# Altium schematic sheet Voltage Regulators.SchDoc: Voltage Regulation
size A4; Author: Khoi Ly; DrawnBy: Khoi Ly; Organization: University of Colorado; Address1: 1111 Engineering Drive; Address2: Boulder; Address3: CO, 870309; Address4: USA; DocumentNumber: 1; Revision: 1; SheetNumber: 3; SheetTotal: 4; DocumentName: Voltage Regulators.SchDoc
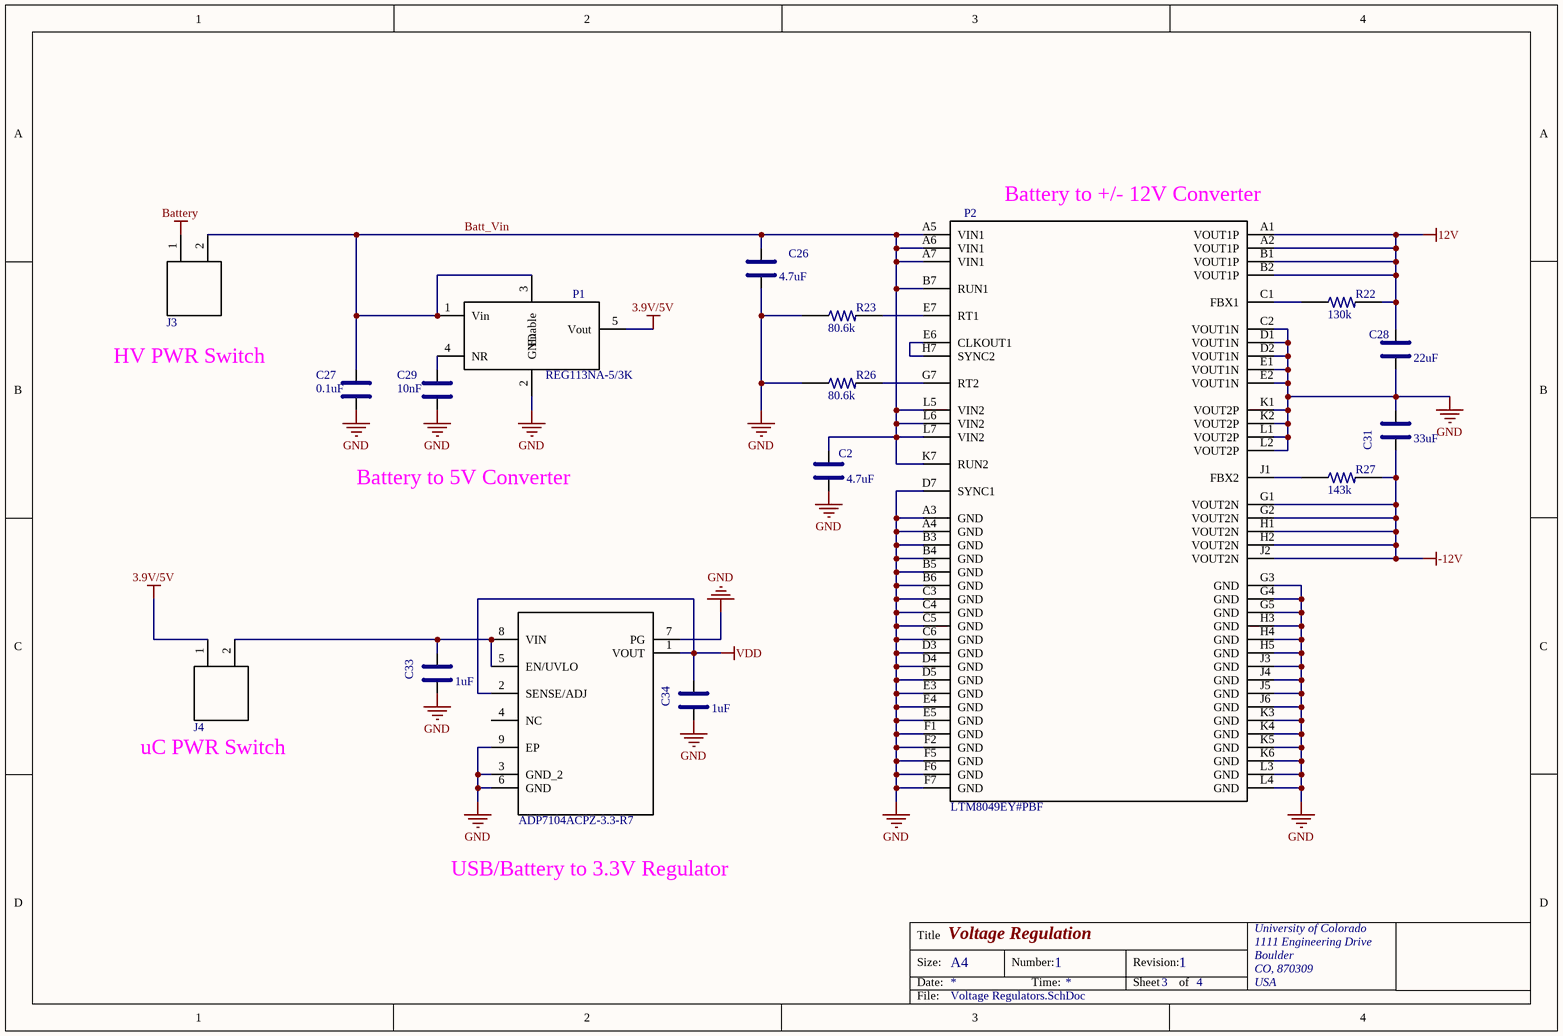
[diagram p0: Voltage Regulators.SchDoc]

## Parts
C2  value 4.7uF  [C0402C102K9RACTU]  (hidden comment: GRM155R60J475)
C26  value 4.7uF  [C0402C102K9RACTU]  (hidden comment: GRM155R60J475)
C27  value 0.1uF  [CL03A104KA3NNNC]  (hidden comment: CL03A104KA3NNNC)
C28  value 22uF  [CL21A226MAQNNNE]  (hidden comment: CL21A226MAQNNNE)
C29  value 10nF  [CL03A104KA3NNNC]  (hidden comment: CL03A104KA3NNNC)
C31  value 33uF  [GRM31CR61E476ME44L]  (hidden comment: GRM31CR61E476ME44L)
C33  value 1uF  [GRM033R60J105MEA2D]  (hidden comment: GRM033R60J105MEA2D)
C34  value 1uF  [GRM033R60J105MEA2D]  (hidden comment: GRM033R60J105MEA2D)
J3  BM02B-SRSS-TBT  [BM02B-SRSS-TBT]  (value not drawn)
J4  BM02B-SRSS-TBT  [BM02B-SRSS-TBT]  (value not drawn)
P1  REG113NA-5/3K  [REG113NA-5/3K]
P2  LTM8049EY#PBF  [LTM8049EY#PBF]
P3  ADP7104ACPZ-3.3-R7  [ADP7104ARDZ-3.3]
R22  value 130k  [RC0201FR-07130KL]  (hidden comment: RC0201FR-07130KL)
R23  value 80.6k  [RC0201FR-0780K6L]  (hidden comment: RC0201FR-0780K6L)
R26  value 80.6k  [RC0201FR-0780K6L]  (hidden comment: RC0201FR-0780K6L)
R27  value 143k  [RC0201FR-07143KL]  (hidden comment: RC0201FR-07143KL)

## Nets
3.9V/5V: J4.1 P1.5(Vout)
12V: C28.1 P2.A1(VOUT1P) P2.A2(VOUT1P) P2.B1(VOUT1P) P2.B2(VOUT1P) R22.1
-12V: C31.2 P2.G1(VOUT2N) P2.G2(VOUT2N) P2.H1(VOUT2N) P2.H2(VOUT2N) P2.J2(VOUT2N) R27.1
Battery: J3.1
GND: C2.2 C26.2 C27.1 C28.2 C29.2 C31.1 C33.2 C34.2 P1.2(GND) P2.A3(GND) P2.A4(GND) P2.B3(GND) P2.B4(GND) P2.B5(GND) P2.B6(GND) P2.C2(VOUT1N) P2.C3(GND) P2.C4(GND) P2.C5(GND) P2.C6(GND) P2.D1(VOUT1N) P2.D2(VOUT1N) P2.D3(GND) P2.D4(GND) P2.D5(GND) P2.D7(SYNC1) P2.E1(VOUT1N) P2.E2(VOUT1N) P2.E3(GND) P2.E4(GND) P2.E5(GND) P2.F1(GND) P2.F2(GND) P2.F5(GND) P2.F6(GND) P2.F7(GND) P2.G3(GND) P2.G4(GND) P2.G5(GND) P2.H3(GND) P2.H4(GND) P2.H5(GND) P2.J3(GND) P2.J4(GND) P2.J5(GND) P2.J6(GND) P2.K1(VOUT2P) P2.K2(VOUT2P) P2.K3(GND) P2.K4(GND) P2.K5(GND) P2.K6(GND) P2.L1(VOUT2P) P2.L2(VOUT2P) P2.L3(GND) P2.L4(GND) P3.3(GND_2) P3.6(GND) P3.7(PG) P3.9(EP) R23.2 R26.2
VDD: C34.1 P3.1(VOUT) P3.2(SENSE/ADJ)
Batt_Vin: C2.1 C26.1 C27.2 J3.2 P1.1(Vin) P1.3(Enable) P2.A5(VIN1) P2.A6(VIN1) P2.A7(VIN1) P2.B7(RUN1) P2.K7(RUN2) P2.L5(VIN2) P2.L6(VIN2) P2.L7(VIN2)
NetC29_1: C29.1 P1.4(NR)
NetC33_1: C33.1 J4.2 P3.5(EN/UVLO) P3.8(VIN)
NetP2_C1: P2.C1(FBX1) R22.2
NetP2_E6: P2.E6(CLKOUT1) P2.H7(SYNC2)
NetP2_E7: P2.E7(RT1) R23.1
NetP2_G7: P2.G7(RT2) R26.1
NetP2_J1: P2.J1(FBX2) R27.2

Not connected (* = marked no-connect by the designer): P3 4(NC)

## Notes on the sheet
- (near P2) Battery to +/- 12V Converter
- HV PWR Switch
- Battery to 5V Converter
- uC PWR Switch
- USB/Battery to 3.3V Regulator
- Title
- Size:
- Date:
- A4
- Number:
- Time:
- Revision:
- Sheet
- of
- File:

## Library data of the parts
C2 C26 = GRM155R60J475: CAP CER 4.7UF 6.3V X5R 0402; Manufacturer: Murata; Manufacturer Part Number: GRM155R60J475ME47D‎; Package: 0402; Digikey Part Number: ‎490-5915-1-ND‎; Voltage Rated: 6.3V; Temperature Coefficient: X5R; Unit Price: $0.55; Supplier: Digikey
C27 C29 = CL03A104KA3NNNC: CAP CER 0.1UF 25V X5R 0201; Manufacturer: Samsung; Package: 0201 (0603 Metric); Manufacturer Part Number: CL03A104KA3NNNC; Digikey Part Number: 1276-1318-6-ND; Voltage Rated: 25V; Temperature Coefficient: X5R; Unit Price: $0.75; Supplier: Digikey
C28 = CL21A226MAQNNNE: CAP CER 22UF 25V X5R 0805; Manufacturer: Samsung; Package: 0603 (1608 Metric); Manufacturer Part Number: CL21A226MAQNNNE; Digikey Part Number: 1276-2908-1-ND; Voltage Rated: 25V; Temperature Coefficient: X5R; Unit Price: $0.75; Supplier: Digikey
C31 = C3216JB1E336M160AC: CAP CER 33UF 25V JB 1206; Manufacturer: TDK Corporation; Temperature Coefficient: X5R; Package: 1206 (3216 Metric); Manufacturer Part Number: C3216JB1E336M160AC; Digikey Part Number: 445-11710-1-ND; Voltage Rated: 25V; Unit Price: $0.75; Supplier: Digikey
C33 C34 = GRM033R60J105MEA2D: CAP CER 1UF 6.3V X5R 0201; Manufacturer: Murata; Package: 0201 (0603 Metric); Manufacturer Part Number: GRM033R60J105MEA2D; Digikey Part Number: 490-7229-1-ND; Voltage Rated: 6.3V; Temperature Coefficient: X5R; Unit Price: $0.15; Supplier: Digikey
J3 J4 = BM02B-SRSS-TBT: CONN WIRE HDR 2POS 1MM STSMD; Manufacturer: JST; Digikey Part Number: 455-2955-1-ND; Unit Price: $7.85; Manufacturer Part Number: BM02B-SRSS-TBT
P1 = REG113NA-5/3K: LDO Voltage Regulators DMOS 400mA Regulator Low-Dropout; Manufacturer: LT; Package: SOT-23-5; Manufacturer Part Number: REG113NA-5/3K; Digikey: REG113NA-5/3KCT-ND; Unit Price: $2.76; Supplier: Digikey
P2 = LTM8049EY#PBF: DC DC CONVERTER +/-2.5 TO +/-24V; Manufacturer: Linear Technology; Digikey Part Number: LTM8049EY#PBF-ND; Manufacturer Part Number: LTM8049EY#PBF; Unit Price: $24.75; Package / Case: 77-BBGA
P3 = ADP7104ACPZ-3.3-R7: IC REG LINEAR 3.3V 500MA 8LFCSP; Manufacturer: Analog Devices; Voltage Output: 3.3V (fixed); Voltage Input: 20V (max); Manufacturer Part Number: ADP7104ACPZ-3.3-R7; Digikey Part Number: ADP7104ACPZ-3.3-R7DKR-ND; Current Output: 500mA; Package: 8-LFCSP_WD; Unit Price: $4.5
R22 = RC0201FR-07130KL: RES SMD 130K OHM 1% 1/20W 0201; Manufacturer: Yageo; Power (Watts): 0.05W; Package: 0201 (0603 Metric); Manufacturer Part Number: RC0201FR-07130KL; Digikey Part Number: YAG2393DKR-ND; Unit Price: 0.1; Supplier: Digikey
R23 R26 = RC0201FR-0780K6L: RES SMD 80.6K OHM 1% 1/20W 0201; Manufacturer: Yageo; Power (Watts): 0.05W; Package: 0201 (0603 Metric); Manufacturer Part Number: RC0201FR-0780K6L; Digikey Part Number: YAG2810DKR-ND; Unit Price: 0.1; Supplier: Digikey
R27 = RC0201FR-07143KL: RES SMD 143K OHM 1% 1/20W 0201; Manufacturer: Yageo; Power (Watts): 0.05W; Package: 0201 (0603 Metric); Manufacturer Part Number: RC0201FR-07143KL; Digikey Part Number: YAG2407CT-ND; Unit Price: 0.1; Supplier: Digikey